# Altium schematic sheet GUI.SchDoc
size A
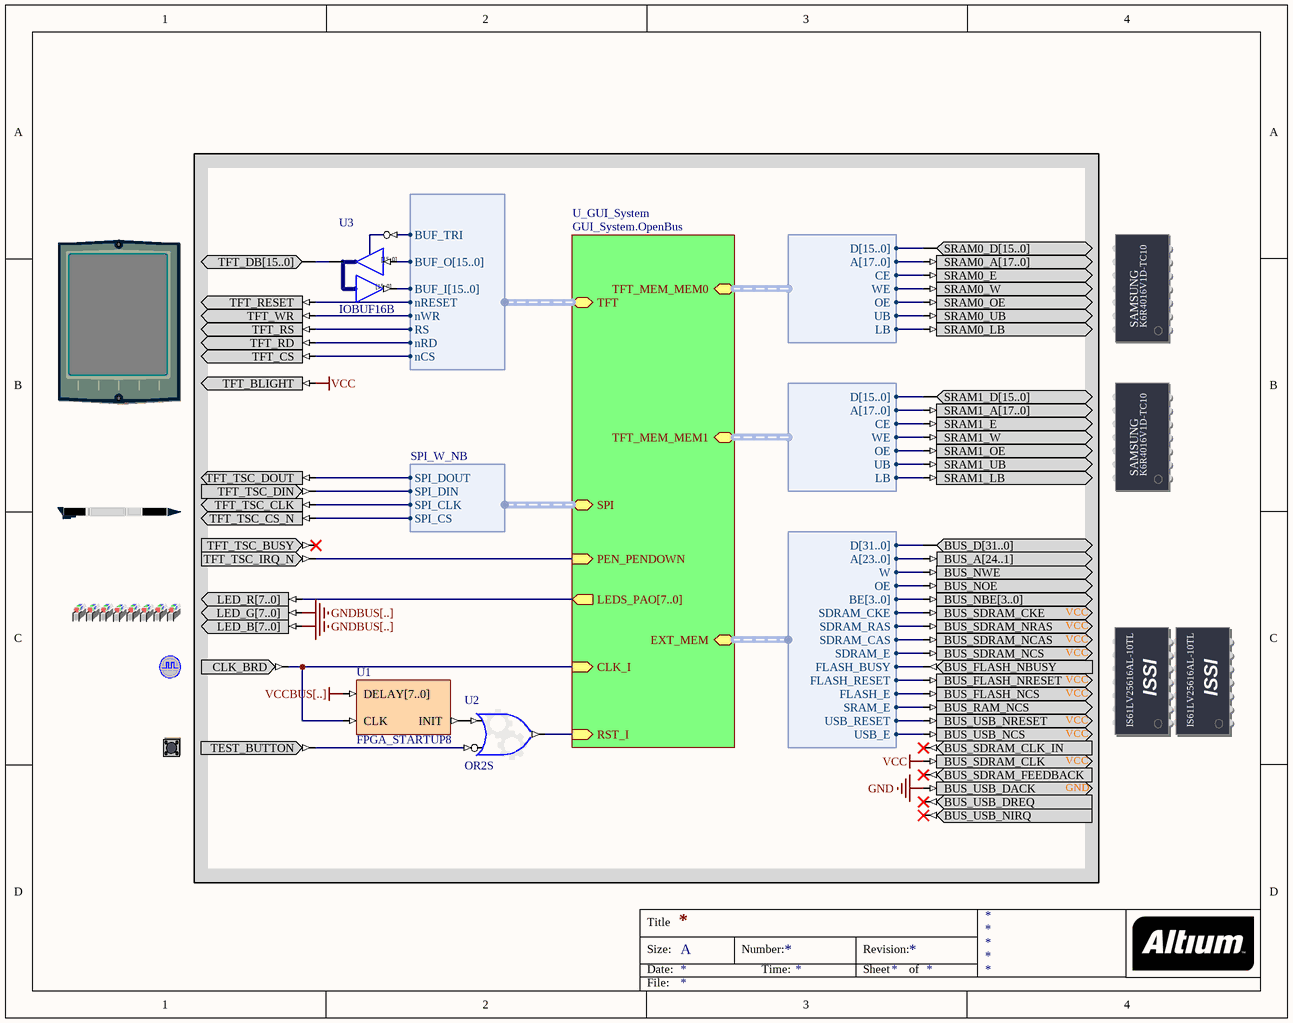
[diagram p0: GUI.SchDoc]

## Parts
(Parts that share a designator on the sheet are numbered #1, #2 ... from top to bottom, then left to right.)
?#1  SRAM_DAUGHTER0  (value not drawn)
?#2  TFT_LCD  (value not drawn)
?#3  SRAM_DAUGHTER1  (value not drawn)
?#4  TOUCH_SCREEN_PEN  (value not drawn)
?#5  SHARED_SRAM  (value not drawn)
?#6  LEDS_RGB  (value not drawn)
?#7  CLOCK_BOARD  (value not drawn)
?#8  TEST_BUTTON  (value not drawn)
U1  FPGA_STARTUP8
U2  OR2S
U3  IOBUF16B

## Sub-sheets
U_GUI_System = GUI_System.OpenBus: RST_I (in), CLK_I (in), PEN_PENDOWN (in), LEDS_PAO[7..0] (out), SPI (harness SPI_W_NB), TFT_MEM_MEM0 (harness WB_MEM_CTRL_SRAM16_A18), TFT_MEM_MEM1 (harness WB_MEM_CTRL_SRAM16_A18), TFT (harness VGA32_ILI9320), EXT_MEM (harness WB_SHARED_MEM_CTRL)

## Harnesses
WB_MEM_CTRL_SRAM16_A18: D[15..0], A[17..0], CE, WE, OE, UB, LB
VGA32_ILI9320: BUF_TRI, BUF_O[15..0], BUF_I[15..0], nRESET, nWR, RS, nRD, nCS
WB_SHARED_MEM_CTRL: D[31..0], A[23..0], W, OE, BE[3..0], SDRAM_CKE, SDRAM_RAS, SDRAM_CAS, SDRAM_E, FLASH_BUSY, FLASH_RESET, FLASH_E, SRAM_E, USB_RESET, USB_E
SPI_W_NB: SPI_DOUT, SPI_DIN, SPI_CLK, SPI_CS

## Nets
GND: ?#5.BUS_USB_DACK
GNDBUS[..]: ?#6.LED_B[7..0] ?#6.LED_G[7..0]
VCC: ?#2.TFT_BLIGHT ?#5.BUS_SDRAM_CLK
VCCBUS[..]: U1.DELAY[7..0]
Net?#1_SRAM0_A[17..0]: ?#1.SRAM0_A[17..0] ; sheet U_GUI_System/TFT_MEM_MEM0.A[17..0]
Net?#1_SRAM0_D[15..0]: ?#1.SRAM0_D[15..0] ; sheet U_GUI_System/TFT_MEM_MEM0.D[15..0]
Net?#1_SRAM0_E: ?#1.SRAM0_E ; sheet U_GUI_System/TFT_MEM_MEM0.CE
Net?#1_SRAM0_LB: ?#1.SRAM0_LB ; sheet U_GUI_System/TFT_MEM_MEM0.LB
Net?#1_SRAM0_OE: ?#1.SRAM0_OE ; sheet U_GUI_System/TFT_MEM_MEM0.OE
Net?#1_SRAM0_UB: ?#1.SRAM0_UB ; sheet U_GUI_System/TFT_MEM_MEM0.UB
Net?#1_SRAM0_W: ?#1.SRAM0_W ; sheet U_GUI_System/TFT_MEM_MEM0.WE
Net?#2_TFT_CS: ?#2.TFT_CS ; sheet U_GUI_System/TFT.nCS
Net?#2_TFT_DB[15..0]: ?#2.TFT_DB[15..0] U3.IO[15..0]
Net?#2_TFT_RD: ?#2.TFT_RD ; sheet U_GUI_System/TFT.nRD
Net?#2_TFT_RESET: ?#2.TFT_RESET ; sheet U_GUI_System/TFT.nRESET
Net?#2_TFT_RS: ?#2.TFT_RS ; sheet U_GUI_System/TFT.RS
Net?#2_TFT_WR: ?#2.TFT_WR ; sheet U_GUI_System/TFT.nWR
Net?#3_SRAM1_A[17..0]: ?#3.SRAM1_A[17..0] ; sheet U_GUI_System/TFT_MEM_MEM1.A[17..0]
Net?#3_SRAM1_D[15..0]: ?#3.SRAM1_D[15..0] ; sheet U_GUI_System/TFT_MEM_MEM1.D[15..0]
Net?#3_SRAM1_E: ?#3.SRAM1_E ; sheet U_GUI_System/TFT_MEM_MEM1.CE
Net?#3_SRAM1_LB: ?#3.SRAM1_LB ; sheet U_GUI_System/TFT_MEM_MEM1.LB
Net?#3_SRAM1_OE: ?#3.SRAM1_OE ; sheet U_GUI_System/TFT_MEM_MEM1.OE
Net?#3_SRAM1_UB: ?#3.SRAM1_UB ; sheet U_GUI_System/TFT_MEM_MEM1.UB
Net?#3_SRAM1_W: ?#3.SRAM1_W ; sheet U_GUI_System/TFT_MEM_MEM1.WE
Net?#4_TFT_TSC_CLK: ?#4.TFT_TSC_CLK ; sheet U_GUI_System/SPI.SPI_CLK
Net?#4_TFT_TSC_CS_N: ?#4.TFT_TSC_CS_N ; sheet U_GUI_System/SPI.SPI_CS
Net?#4_TFT_TSC_DIN: ?#4.TFT_TSC_DIN ; sheet U_GUI_System/SPI.SPI_DIN
Net?#4_TFT_TSC_DOUT: ?#4.TFT_TSC_DOUT ; sheet U_GUI_System/SPI.SPI_DOUT
Net?#4_TFT_TSC_IRQ_N: ?#4.TFT_TSC_IRQ_N ; sheet U_GUI_System/PEN_PENDOWN
Net?#5_BUS_A[24..1]: ?#5.BUS_A[24..1] ; sheet U_GUI_System/EXT_MEM.A[23..0]
Net?#5_BUS_D[31..0]: ?#5.BUS_D[31..0] ; sheet U_GUI_System/EXT_MEM.D[31..0]
Net?#5_BUS_FLASH_NBUSY: ?#5.BUS_FLASH_NBUSY ; sheet U_GUI_System/EXT_MEM.FLASH_BUSY
Net?#5_BUS_FLASH_NCS: ?#5.BUS_FLASH_NCS ; sheet U_GUI_System/EXT_MEM.FLASH_E
Net?#5_BUS_FLASH_NRESET: ?#5.BUS_FLASH_NRESET ; sheet U_GUI_System/EXT_MEM.FLASH_RESET
Net?#5_BUS_NBE[3..0]: ?#5.BUS_NBE[3..0] ; sheet U_GUI_System/EXT_MEM.BE[3..0]
Net?#5_BUS_NOE: ?#5.BUS_NOE ; sheet U_GUI_System/EXT_MEM.OE
Net?#5_BUS_NWE: ?#5.BUS_NWE ; sheet U_GUI_System/EXT_MEM.W
Net?#5_BUS_RAM_NCS: ?#5.BUS_RAM_NCS ; sheet U_GUI_System/EXT_MEM.SRAM_E
Net?#5_BUS_SDRAM_CKE: ?#5.BUS_SDRAM_CKE ; sheet U_GUI_System/EXT_MEM.SDRAM_CKE
Net?#5_BUS_SDRAM_NCAS: ?#5.BUS_SDRAM_NCAS ; sheet U_GUI_System/EXT_MEM.SDRAM_CAS
Net?#5_BUS_SDRAM_NCS: ?#5.BUS_SDRAM_NCS ; sheet U_GUI_System/EXT_MEM.SDRAM_E
Net?#5_BUS_SDRAM_NRAS: ?#5.BUS_SDRAM_NRAS ; sheet U_GUI_System/EXT_MEM.SDRAM_RAS
Net?#5_BUS_USB_NCS: ?#5.BUS_USB_NCS ; sheet U_GUI_System/EXT_MEM.USB_E
Net?#5_BUS_USB_NRESET: ?#5.BUS_USB_NRESET ; sheet U_GUI_System/EXT_MEM.USB_RESET
Net?#6_LED_R[7..0]: ?#6.LED_R[7..0] ; sheet U_GUI_System/LEDS_PAO[7..0]
Net?#7_CLK_BRD: ?#7.CLK_BRD U1.CLK ; sheet U_GUI_System/CLK_I
Net?#8_TEST_BUTTON: ?#8.TEST_BUTTON U2.I1
NetU1_INIT: U1.INIT U2.I0
NetU2_O: U2.O ; sheet U_GUI_System/RST_I
NetU3_I[15..0]: U3.I[15..0] ; sheet U_GUI_System/TFT.BUF_O[15..0]
NetU3_O[15..0]: U3.O[15..0] ; sheet U_GUI_System/TFT.BUF_I[15..0]
NetU3_T: U3.T ; sheet U_GUI_System/TFT.BUF_TRI

Not connected (* = marked no-connect by the designer): ?#4 TFT_TSC_BUSY*; ?#5 BUS_SDRAM_CLK_IN* BUS_SDRAM_FEEDBACK* BUS_USB_DREQ* BUS_USB_NIRQ*

## Notes on the sheet
- Title
- Size:
- Date:
- A
- Number:
- Time:
- Revision:
- Sheet
- of
- File:
- (in symbol IOBUF16B) [15..0]
- (in symbol SHARED_SRAM) VCC; ISSI; IS61LV25616AL-10TL; GND
- (in symbol SRAM_DAUGHTER0) SAMSUNG; K6R4016V1D-TC10
- (in symbol SRAM_DAUGHTER1) SAMSUNG; K6R4016V1D-TC10

## Library data of the parts
?#1 = SRAM_DAUGHTER0: Free Static RAM - Daughterboard; PortComponent: True; Published: 14-May-2007; Publisher: Altium Limited; HelpURL: TR0149 Technical Reference for Altium's Xilinx Spartan-3 Daughter Board DB30.pdf#page=16
?#2 = TFT_LCD: TFT LCD Panel; PortComponent: True; Published: 22-Jan-2007; Publisher: Altium Limited; HelpURL: https://wiki.altium.com/display/ADOH/NanoBoard+3000+-+TFT+LCD+Panel+%28with+Touch+Screen%29
?#3 = SRAM_DAUGHTER1: Free Static RAM - Daughterboard; PortComponent: True; Published: 14-May-2007; Publisher: Altium Limited; HelpURL: TR0149 Technical Reference for Altium's Xilinx Spartan-3 Daughter Board DB30.pdf#page=16
?#4 = TFT_PEN: Touch Screen Pen Control; PortComponent: True; Published: 22-Jan-2007; Publisher: Altium Limited; HelpURL: https://wiki.altium.com/display/ADOH/NanoBoard+3000+-+TFT+LCD+Panel+%28with+Touch+Screen%29
?#5 = SHARED_SRAM: Common-Bus SRAM; PortComponent: True; Published: 14-May-2007; Publisher: Altium Limited; HelpURL: https://wiki.altium.com/display/ADOH/Accessing+Common-Bus+Resources+on+the+NanoBoard+3000
?#6 = LEDS_RGB: LEDS RGB; PortComponent: True; Published: 11-Mar-2009; Publisher: Altium Limited; HelpURL: https://wiki.altium.com/display/ADOH/NanoBoard+3000+-+RGB+User+LEDs
?#7 = CLOCK_BOARD: Global System Clock Supply; PortComponent: True; Published: 19-Nov-2003; Publisher: Altium Limited; HelpURL: TR0143 Technical Reference Manual for Altium's Desktop NanoBoard NB2DSK01.pdf#page=41; UseInDSF: True
?#8 = TEST_BUTTON: Test / Reset Button; PortComponent: True; Published: 19-Nov-2003; Publisher: Altium Limited; HelpURL: TR0143 Technical Reference Manual for Altium's Desktop NanoBoard NB2DSK01.pdf#page=53
U1 = FPGA_STARTUP8: FPGA Startup With 8 Bit Delay; Published: 9-Dec-2004; Publisher: Altium Limited; HelpURL: CR0119 FPGA_STARTUPx Powerup Delay Unit.pdf; LastRevisionNo: 1.00.00; ComponentLink1Description: Core &Resource Usage; ComponentLink1URL: CR0139 FPGA Peripheral Resource Usage.pdf#page=11
U2 = GATE: Configurable Generic Gate; ConfiguratorName: GENERIC_GATE; ConfigurationParameters: {}Version[1.0]{}GateKind[OR]{}BusInput[False]{}GateInputType[Bit]{}GateOutputOption[Normal]{}BusWidth[8]{}RegisterOutputs[False]{}NegativeClockEdge[False]{}InputCount[2]{}InputInvert0[False]{}InputInvert1[True]{}; LastRevisionNo: 1.00.00; Published: 3-Sep-2008; Publisher: Altium Limited
U3 = IOBUF16B: 16-Bit Input/Output Buffer, Bus Version; SubClass: IOBUF; Enable: Low; Control: Common Control T; PortSize: 16; ArchiveName: GENERIC; VHDLIB_SIM: GENERIC_LIB; Published: 29-Jan-2004; Publisher: Altium Limited; LastRevisionNo: 1.00.00; HelpURL: CR0118 FPGA Generic Library Guide.pdf#page=293; ComponentLink1URL: CR0125 FPGA Buffer Resource Usage.pdf#page=91; ComponentLink1Description: Core &Resource Usage; FunctionalClass: Buffer; PortStyle: Bus Version